# Altium project LightLink_V4.PrjPcb (part 3 of 3)
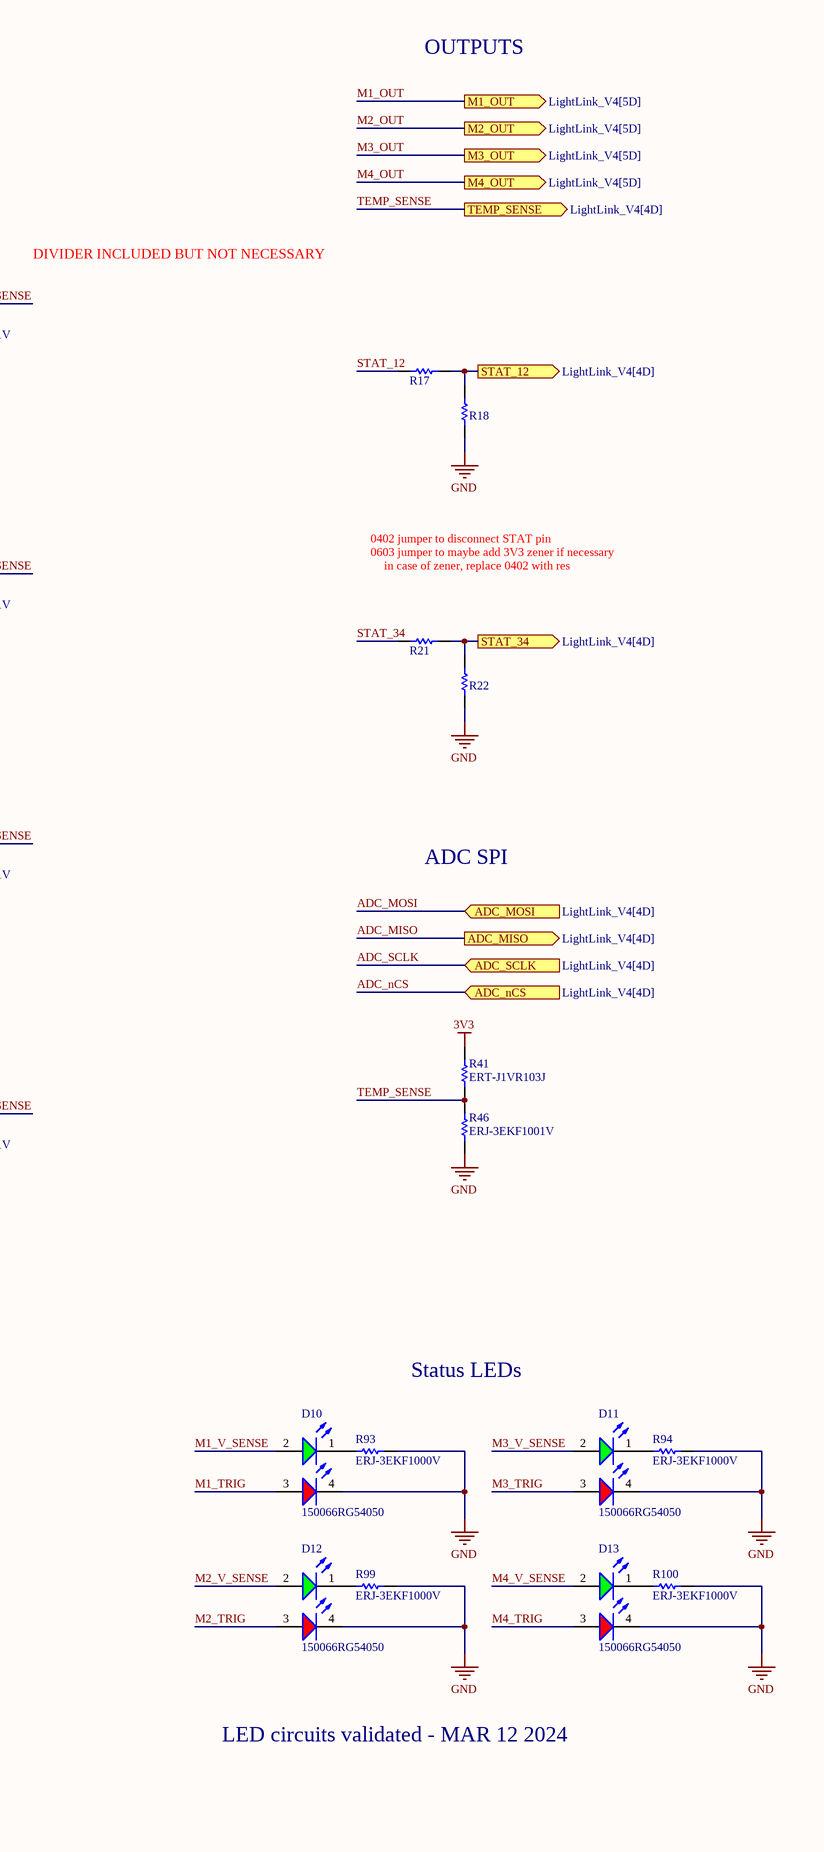
[diagram p14: MOSFET_BANK.SchDoc, right]

## Nets that join several sheets
3V3: INTERNAL_REGULATORS (5 pins), STM32H730_PINOUT (35 pins), MOSFET_BANK (6 pins), MOSFET_BANK (6 pins), MOSFET_BANK (6 pins)
+12: LightLink_V4 (6 pins), PWR_MGMT (Q10.5-6-7-8 Q13.5-6-7-8 R9.1)
GND: LightLink_V4 (25 pins), PWR_MGMT (9 pins), INTERNAL_REGULATORS (5 pins), STM32H730_PINOUT (60 pins), MOSFET_BANK (27 pins), MOSFET_BANK (27 pins), MOSFET_BANK (27 pins)
VCC: PWR_MGMT (Q3.5-6-7-8 Q7.5-6-7-8 R11.1), INTERNAL_REGULATORS (C23.1 U3.2 U3.3), STM32H730_PINOUT (C35.2 LS2.P U10.3), MOSFET_BANK (9 pins), MOSFET_BANK (9 pins), MOSFET_BANK (9 pins)
12V_IN: LightLink_V4 (J6.1 J6.3), PWR_MGMT (F2.1)
12V_INH: PWR_MGMT (D5.2), STM32H730_PINOUT (U1.62)
12V_SENSE: PWR_MGMT (R9.2 R14.2), STM32H730_PINOUT (U2.4)
ADC_MISO: STM32H730_PINOUT (U1.43), MOSFET_BANK (U9_MOSFET_BANK#2.15)
ADC_MISO: STM32H730_PINOUT (U1.30), MOSFET_BANK (U9_MOSFET_BANK#1.15)
ADC_MISO: STM32H730_PINOUT (U1.53), MOSFET_BANK (U9_MOSFET_BANK#3.15)
ADC_MOSI: STM32H730_PINOUT (U1.44), MOSFET_BANK (U9_MOSFET_BANK#2.14)
ADC_MOSI: STM32H730_PINOUT (U1.31), MOSFET_BANK (U9_MOSFET_BANK#1.14)
ADC_MOSI: STM32H730_PINOUT (U1.54), MOSFET_BANK (U9_MOSFET_BANK#3.14)
ADC_nCS: STM32H730_PINOUT (U1.41), MOSFET_BANK (U9_MOSFET_BANK#2.1)
ADC_nCS: STM32H730_PINOUT (U1.28), MOSFET_BANK (U9_MOSFET_BANK#1.1)
ADC_nCS: STM32H730_PINOUT (U1.51), MOSFET_BANK (U9_MOSFET_BANK#3.1)
ADC_SCLK: STM32H730_PINOUT (U1.42), MOSFET_BANK (U9_MOSFET_BANK#2.16)
ADC_SCLK: STM32H730_PINOUT (U1.29), MOSFET_BANK (U9_MOSFET_BANK#1.16)
ADC_SCLK: STM32H730_PINOUT (U1.52), MOSFET_BANK (U9_MOSFET_BANK#3.16)
ADDR_1: LightLink_V4 (J5.2), STM32H730_PINOUT (U1.68)
ADDR_2: LightLink_V4 (J5.5), STM32H730_PINOUT (U1.67)
ADDR_3: LightLink_V4 (J7.2), STM32H730_PINOUT (U1.66)
ADDR_4: LightLink_V4 (J7.5), STM32H730_PINOUT (U1.65)
ADDR_5: LightLink_V4 (J8.2), STM32H730_PINOUT (U1.64)
ADDR_6: LightLink_V4 (J8.5), STM32H730_PINOUT (U1.63)
CAN_INH: PWR_MGMT (D3.2 R2.1), STM32H730_PINOUT (TP1.1 U4.7)
CAN_N: LightLink_V4 (J9.1), STM32H730_PINOUT (5 pins)
CAN_P: LightLink_V4 (J9.4), STM32H730_PINOUT (5 pins)
CAN_PWR: LightLink_V4 (J9.6 R15.1), STM32H730_PINOUT (D6.2)
INT_3V3_SENSE: INTERNAL_REGULATORS (R105.1 R106.2), STM32H730_PINOUT (U2.7)
M1_OUT: LightLink_V4 (J1.8), MOSFET_BANK (R52_MOSFET_BANK#1.2 R53_MOSFET_BANK#1.2 R54_MOSFET_BANK#1.2)
M1_OUT: LightLink_V4 (J2.8), MOSFET_BANK (R52_MOSFET_BANK#2.2 R53_MOSFET_BANK#2.2 R54_MOSFET_BANK#2.2)
M1_OUT: LightLink_V4 (J3.8), MOSFET_BANK (R52_MOSFET_BANK#3.2 R53_MOSFET_BANK#3.2 R54_MOSFET_BANK#3.2)
M1_TRIG: STM32H730_PINOUT (U1.32), MOSFET_BANK (R47_MOSFET_BANK#1.2)
M2_OUT: LightLink_V4 (J1.7), MOSFET_BANK (R66_MOSFET_BANK#1.2 R67_MOSFET_BANK#1.2 R68_MOSFET_BANK#1.2)
M2_OUT: LightLink_V4 (J2.7), MOSFET_BANK (R66_MOSFET_BANK#2.2 R67_MOSFET_BANK#2.2 R68_MOSFET_BANK#2.2)
M2_OUT: LightLink_V4 (J3.7), MOSFET_BANK (R66_MOSFET_BANK#3.2 R67_MOSFET_BANK#3.2 R68_MOSFET_BANK#3.2)
M2_TRIG: STM32H730_PINOUT (U1.34), MOSFET_BANK (R57_MOSFET_BANK#1.2)
M3_OUT: LightLink_V4 (J1.6), MOSFET_BANK (R76_MOSFET_BANK#1.2 R77_MOSFET_BANK#1.2 R78_MOSFET_BANK#1.2)
M3_OUT: LightLink_V4 (J2.6), MOSFET_BANK (R76_MOSFET_BANK#2.2 R77_MOSFET_BANK#2.2 R78_MOSFET_BANK#2.2)
M3_OUT: LightLink_V4 (J3.6), MOSFET_BANK (R76_MOSFET_BANK#3.2 R77_MOSFET_BANK#3.2 R78_MOSFET_BANK#3.2)
M3_TRIG: STM32H730_PINOUT (U1.35), MOSFET_BANK (R48_MOSFET_BANK#1.2)
M4_OUT: LightLink_V4 (J1.5), MOSFET_BANK (R86_MOSFET_BANK#1.2 R87_MOSFET_BANK#1.2 R88_MOSFET_BANK#1.2)
M4_OUT: LightLink_V4 (J2.5), MOSFET_BANK (R86_MOSFET_BANK#2.2 R87_MOSFET_BANK#2.2 R88_MOSFET_BANK#2.2)
M4_OUT: LightLink_V4 (J3.5), MOSFET_BANK (R86_MOSFET_BANK#3.2 R87_MOSFET_BANK#3.2 R88_MOSFET_BANK#3.2)
M4_TRIG: STM32H730_PINOUT (U1.37), MOSFET_BANK (R58_MOSFET_BANK#1.2)
M5_TRIG: STM32H730_PINOUT (U1.38), MOSFET_BANK (R47_MOSFET_BANK#2.2)
M6_TRIG: STM32H730_PINOUT (U1.40), MOSFET_BANK (R57_MOSFET_BANK#2.2)
M7_TRIG: STM32H730_PINOUT (U1.45), MOSFET_BANK (R48_MOSFET_BANK#2.2)
M8_TRIG: STM32H730_PINOUT (U1.47), MOSFET_BANK (R58_MOSFET_BANK#2.2)
M9_TRIG: STM32H730_PINOUT (U1.55), MOSFET_BANK (R47_MOSFET_BANK#3.2)
M10_TRIG: STM32H730_PINOUT (U1.57), MOSFET_BANK (R57_MOSFET_BANK#3.2)
M11_TRIG: STM32H730_PINOUT (U1.58), MOSFET_BANK (R48_MOSFET_BANK#3.2)
M12_STAT: STM32H730_PINOUT (U1.33), MOSFET_BANK (R17_MOSFET_BANK#1.2 R18_MOSFET_BANK#1.2)
M12_TRIG: STM32H730_PINOUT (U1.60), MOSFET_BANK (R58_MOSFET_BANK#3.2)
M34_STAT: STM32H730_PINOUT (U1.36), MOSFET_BANK (R21_MOSFET_BANK#1.2 R22_MOSFET_BANK#1.2)
M56_STAT: STM32H730_PINOUT (U1.39), MOSFET_BANK (R17_MOSFET_BANK#2.2 R18_MOSFET_BANK#2.2)
M78_STAT: STM32H730_PINOUT (U1.46), MOSFET_BANK (R21_MOSFET_BANK#2.2 R22_MOSFET_BANK#2.2)
M910_STAT: STM32H730_PINOUT (U1.56), MOSFET_BANK (R17_MOSFET_BANK#3.2 R18_MOSFET_BANK#3.2)
M1112_STAT: STM32H730_PINOUT (U1.59), MOSFET_BANK (R21_MOSFET_BANK#3.2 R22_MOSFET_BANK#3.2)
M1234_TEMP: STM32H730_PINOUT (U2.9), MOSFET_BANK (R41_MOSFET_BANK#1.1 R46_MOSFET_BANK#1.2)
M5678_TEMP: STM32H730_PINOUT (U2.10), MOSFET_BANK (R41_MOSFET_BANK#2.1 R46_MOSFET_BANK#2.2)
M9101112_TEMP: STM32H730_PINOUT (U2.11), MOSFET_BANK (R41_MOSFET_BANK#3.1 R46_MOSFET_BANK#3.2)
PRE_12V_SENSE: PWR_MGMT (R8.2 R13.2), STM32H730_PINOUT (U2.5)
PWR_IN: LightLink_V4 (5 pins), PWR_MGMT (F1.1)
VCC_SENSE: PWR_MGMT (R11.2 R16.2), STM32H730_PINOUT (U2.8)